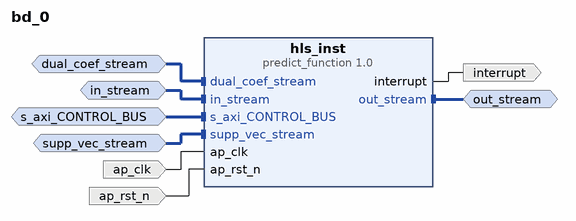
[diagram p0: block diagram of the top level]
# Vivado block design bd_0, xc7z020clg400-1, Vivado 2019.1
create_bd_design bd_0

create_bd_intf_port -mode Slave -vlnv xilinx.com:interface:axis_rtl:1.0 dual_coef_stream
set_property -dict [list \
  CONFIG.FREQ_HZ 100000000.0 \
  CONFIG.HAS_TKEEP 1 \
  CONFIG.HAS_TLAST 1 \
  CONFIG.HAS_TREADY 1 \
  CONFIG.HAS_TSTRB 1 \
  CONFIG.LAYERED_METADATA undef \
  CONFIG.TDATA_NUM_BYTES 4 \
  CONFIG.TDEST_WIDTH 5 \
  CONFIG.TID_WIDTH 5 \
  CONFIG.TUSER_WIDTH 4 \
] [get_bd_intf_ports dual_coef_stream]
create_bd_intf_port -mode Slave -vlnv xilinx.com:interface:axis_rtl:1.0 in_stream
set_property -dict [list \
  CONFIG.FREQ_HZ 100000000.0 \
  CONFIG.HAS_TKEEP 1 \
  CONFIG.HAS_TLAST 1 \
  CONFIG.HAS_TREADY 1 \
  CONFIG.HAS_TSTRB 1 \
  CONFIG.LAYERED_METADATA undef \
  CONFIG.TDATA_NUM_BYTES 4 \
  CONFIG.TDEST_WIDTH 5 \
  CONFIG.TID_WIDTH 5 \
  CONFIG.TUSER_WIDTH 4 \
] [get_bd_intf_ports in_stream]
create_bd_intf_port -mode Master -vlnv xilinx.com:interface:axis_rtl:1.0 out_stream
set_property -dict {CONFIG.FREQ_HZ 100000000.0} [get_bd_intf_ports out_stream]
create_bd_intf_port -mode Slave -vlnv xilinx.com:interface:aximm_rtl:1.0 s_axi_CONTROL_BUS
set_property -dict [list \
  CONFIG.ADDR_WIDTH 12 \
  CONFIG.ARUSER_WIDTH 0 \
  CONFIG.AWUSER_WIDTH 0 \
  CONFIG.BUSER_WIDTH 0 \
  CONFIG.DATA_WIDTH 32 \
  CONFIG.FREQ_HZ 100000000.0 \
  CONFIG.HAS_BRESP 1 \
  CONFIG.HAS_BURST 0 \
  CONFIG.HAS_CACHE 0 \
  CONFIG.HAS_LOCK 0 \
  CONFIG.HAS_PROT 0 \
  CONFIG.HAS_QOS 0 \
  CONFIG.HAS_REGION 0 \
  CONFIG.HAS_RRESP 1 \
  CONFIG.HAS_WSTRB 1 \
  CONFIG.ID_WIDTH 0 \
  CONFIG.MAX_BURST_LENGTH 1 \
  CONFIG.NUM_READ_OUTSTANDING 1 \
  CONFIG.NUM_READ_THREADS 1 \
  CONFIG.NUM_WRITE_OUTSTANDING 1 \
  CONFIG.NUM_WRITE_THREADS 1 \
  CONFIG.PROTOCOL AXI4LITE \
  CONFIG.READ_WRITE_MODE READ_WRITE \
  CONFIG.RUSER_BITS_PER_BYTE 0 \
  CONFIG.RUSER_WIDTH 0 \
  CONFIG.SUPPORTS_NARROW_BURST 0 \
  CONFIG.WUSER_BITS_PER_BYTE 0 \
  CONFIG.WUSER_WIDTH 0 \
] [get_bd_intf_ports s_axi_CONTROL_BUS]
create_bd_intf_port -mode Slave -vlnv xilinx.com:interface:axis_rtl:1.0 supp_vec_stream
set_property -dict [list \
  CONFIG.FREQ_HZ 100000000.0 \
  CONFIG.HAS_TKEEP 1 \
  CONFIG.HAS_TLAST 1 \
  CONFIG.HAS_TREADY 1 \
  CONFIG.HAS_TSTRB 1 \
  CONFIG.LAYERED_METADATA undef \
  CONFIG.TDATA_NUM_BYTES 4 \
  CONFIG.TDEST_WIDTH 5 \
  CONFIG.TID_WIDTH 5 \
  CONFIG.TUSER_WIDTH 4 \
] [get_bd_intf_ports supp_vec_stream]
create_bd_port -dir I -type clk ap_clk
set_property -dict {CONFIG.FREQ_HZ 100000000.0} [get_bd_ports ap_clk]
create_bd_port -dir I -type rst ap_rst_n
create_bd_port -dir O -type intr interrupt

create_bd_cell -type ip -vlnv xilinx.com:hls:predict_function:1.0 hls_inst

# ---- connections ----

connect_bd_intf_net -intf_net dual_coef_stream_0_1 [get_bd_intf_ports dual_coef_stream] [get_bd_intf_pins hls_inst/dual_coef_stream]
connect_bd_intf_net [get_bd_intf_ports out_stream] [get_bd_intf_pins hls_inst/out_stream]
connect_bd_intf_net -intf_net in_stream_0_1 [get_bd_intf_ports in_stream] [get_bd_intf_pins hls_inst/in_stream]
connect_bd_intf_net -intf_net s_axi_CONTROL_BUS_0_1 [get_bd_intf_ports s_axi_CONTROL_BUS] [get_bd_intf_pins hls_inst/s_axi_CONTROL_BUS]
connect_bd_intf_net -intf_net supp_vec_stream_0_1 [get_bd_intf_ports supp_vec_stream] [get_bd_intf_pins hls_inst/supp_vec_stream]
connect_bd_net -net ap_clk_0_1 [get_bd_ports ap_clk] [get_bd_pins hls_inst/ap_clk]
connect_bd_net -net ap_rst_n_0_1 [get_bd_ports ap_rst_n] [get_bd_pins hls_inst/ap_rst_n]
connect_bd_net [get_bd_pins hls_inst/interrupt] [get_bd_ports interrupt]

# ---- address map ----
assign_bd_address -offset 0x000 -range 4K -target_address_space [get_bd_addr_spaces s_axi_CONTROL_BUS] [get_bd_addr_segs hls_inst/s_axi_CONTROL_BUS/Reg]

validate_bd_design
save_bd_design
